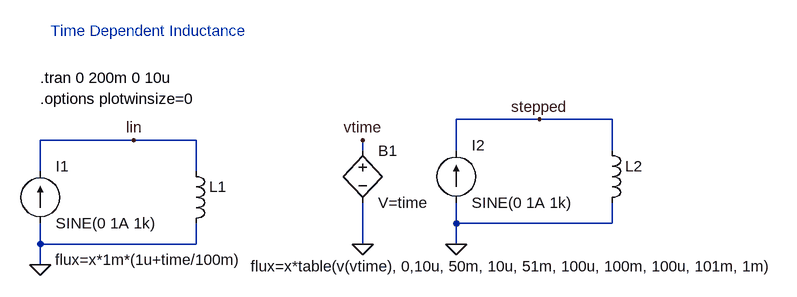
[diagram p0: schematic inductance_vs_time.asc]
inductance_vs_time.asc, the LTspice schematic file:
Version 4
SHEET 1 2172 680
WIRE 1056 80 928 80
WIRE 1168 80 1056 80
WIRE 432 112 288 112
WIRE 528 112 432 112
WIRE 784 128 784 112
WIRE 928 128 928 80
WIRE 1168 128 1168 80
WIRE 288 160 288 112
WIRE 528 160 528 112
WIRE 928 240 928 208
WIRE 1168 240 1168 208
WIRE 1168 240 928 240
WIRE 288 272 288 240
WIRE 528 272 528 240
WIRE 528 272 288 272
WIRE 784 272 784 208
WIRE 928 272 928 240
WIRE 288 304 288 272
FLAG 288 304 0
FLAG 928 272 0
FLAG 784 272 0
FLAG 784 112 vtime
FLAG 432 112 lin
FLAG 1056 80 stepped
SYMBOL ind 512 144 R0
WINDOW 3 -201 152 Left 0
SYMATTR InstName L1
SYMATTR Value flux=x*1m*(1u+time/100m)
SYMBOL current 288 240 M180
WINDOW 0 24 88 Left 0
WINDOW 3 24 0 Left 0
WINDOW 123 0 0 Left 0
WINDOW 39 0 0 Left 0
SYMATTR InstName I1
SYMATTR Value SINE(0 1A 1k)
SYMBOL ind 1152 112 R0
WINDOW 3 -540 194 Left 0
SYMATTR InstName L2
SYMATTR Value flux=x*table(v(vtime), 0,10u, 50m, 10u, 51m, 100u, 100m, 100u, 101m, 1m)
SYMBOL current 928 208 M180
WINDOW 0 24 88 Left 0
WINDOW 3 24 0 Left 0
WINDOW 123 0 0 Left 0
WINDOW 39 0 0 Left 0
SYMATTR InstName I2
SYMATTR Value SINE(0 1A 1k)
SYMBOL bv 784 112 R0
SYMATTR InstName B1
SYMATTR Value V=time
TEXT 288 16 Left 0 !.tran 0 200m 0 10u
TEXT 288 48 Left 0 !.options plotwinsize=0
TEXT 304 -56 Left 0 ;Time Dependent Inductance

The netlist it stands for:
* inductance_vs_time.asc
L1 lin 0 flux=x*1m*(1u+time/100m)
I1 0 lin SINE(0 1A 1k)
L2 stepped 0 flux=x*table(v(vtime), 0,10u, 50m, 10u, 51m, 100u, 100m, 100u, 101m, 1m)
I2 0 stepped SINE(0 1A 1k)
B1 vtime 0 V=time
.tran 0 200m 0 10u
.options plotwinsize=0
* Time Dependent Inductance
.backanno
.end